# Altium schematic sheet H_BRIDGE.SchDoc
size A4; SheetNumber: 6; SheetTotal: 13
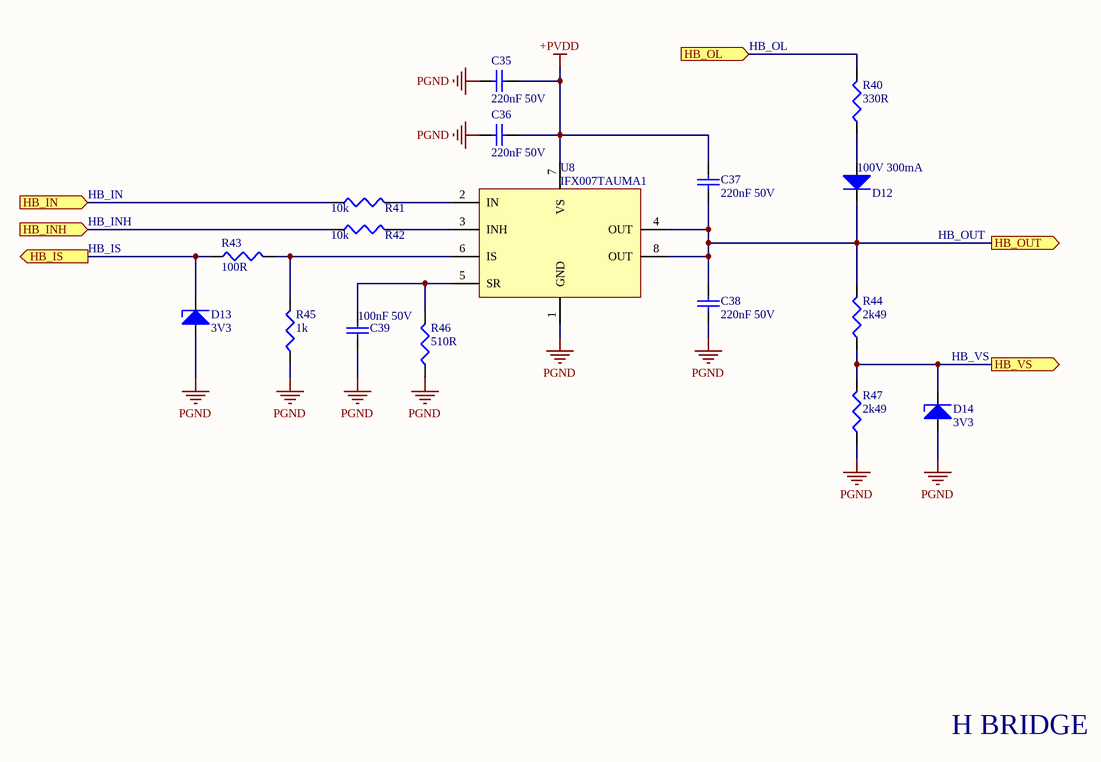
[diagram p0: H_BRIDGE.SchDoc]

## Parts
C35  220nF 50V  [CAP1206]
C36  220nF 50V  [CAP1206]
C37  220nF 50V  [CAP1206]
C38  220nF 50V  [CAP1206]
C39  100nF 50V  [CAP0603]
D12  100V 300mA  [SOD123_1N4148W-7-F]
D13  3V3  [SOD323]
D14  3V3  [SOD323]
R40  330R  [RES0603]
R41  10k  [RES0603]
R42  10k  [RES0603]
R43  100R  [RES0603]
R44  2k49  [RES0603]
R45  1k  [RES0603]
R46  510R  [RES0603]
R47  2k49  [RES0603]
U8  P/N: IFX007TAUMA1  [TO-263-8]  (hidden comment: 55A)

## Ports
HB_IN (in), HB_INH (in), HB_IS (out), HB_OL (in), HB_OUT (out), HB_VS (out)

## Nets
+PVDD: C35.2 C36.2 C37.1 U8.7(VS)
PGND: C35.1 C36.1 C38.2 C39.1 D13.2(A) D14.2(A) R45.1 R46.1 R47.1 U8.1(GND)
HB_IN: R41.1 ; port HB_IN
HB_INH: R42.1 ; port HB_INH
HB_IS: D13.1(K) R43.1 ; port HB_IS
HB_OL: R40.2 ; port HB_OL
HB_OUT: C37.2 C38.1 D12.2(K) R44.2 U8.4(OUT) U8.8(OUT) ; port HB_OUT
HB_VS: D14.1(K) R44.1 R47.2 ; port HB_VS
NetC39_2: C39.2 R46.2 U8.5(SR)
NetD12_1: D12.1(A) R40.1
NetR41_2: R41.2 U8.2(IN)
NetR42_2: R42.2 U8.3(INH)
NetR43_2: R43.2 R45.2 U8.6(IS)

## Notes on the sheet
- HB_OL
- HB_IN
- HB_INH
- HB_IS
- HB_OUT
- (near D14) HB_VS
- H BRIDGE

## Library data of the parts
C35-C38 = CAP1206_220nF: CAP CER 0.22UF 50V X7R 1206; P/N: CL31B224KBFNNNE; Order Code: DIGI : CL31B224KBFNNNE; Value: 220nF
C39 = CAP0603_100nF: CAP CER 0.1UF 50V X7R 0603; P/N: C0603C104K5RACTU; Order Code: DIGI : 399-5089-1-ND; Value: 100nF 50V
D12 = DIODE_1N4148W-7-F: DIODE GEN PURP 100V 300MA SOD123; Order Code: DIGI : 1N4148W-FDICT-ND; P/N: 1N4148W-7-F; Value: 100V 300mA
D13 D14 = ZENER_3V3_MM3Z3V3T1G: DIODE ZENER 3.3V 300MW SOD323; Order Code: DIGI : MM3Z3V3T1GOSCT-ND; P/N: MM3Z3V3T1G; Value: 3V3
R40 = RES0603_330R: RES 330 OHM 1% 1/10W 0603; Order Code: DIGI : RMCF0603FT330RCT-ND; P/N: RMCF0603FT330R; ART Code: ART0021648; Value: 330R
R41 R42 = RES0603_10k: RES SMD 10K OHM 5% 1/10W 0603; Order Code: DIGI : 311-10KGRCT-ND; P/N: RC0603JR-0710KL; ART Code: ART0020747; Value: 10k
R43 = RES0603_100R: RES SMD 100R OHM 1% 1/10W 0603; Order Code: DIGI : RMCF0603FT100RCT-ND; P/N: RMCF0603FT100R; ART Code: ART0022201; Value: 100R
R44 R47 = RES0603_2k49: RES 2.49K OHM 1% 1/10W 0603; Order Code: DIGI : RMCF0603FT2K49CT-ND; P/N: RMCF0603FT2K49; ART Code: ART0014241; Value: 2k49
R45 = RES0603_1k: RES SMD 1K OHM 1% 1/10W 0603; Order Code: DIGI : 311-1.00KHRCT-ND; P/N: RC0603FR-071KL; ART Code: ART0014240; Value: 1k
R46 = RES0603_510R: RES 510R OHM 1% 1/10W 0603; Order Code: DIGI : RMCF0603FT510RCT-ND; P/N: RMCF0603FT510R; Value: 510R
U8 = HB_IFX007TAUMA1: IC HALF-BRIDGE DRVR 2 CH TO263; Order Code: DIGI : IFX007TAUMA1CT-ND; Value: 55A